# EAGLE design Solar_revb (EAGLE 7.7.0)
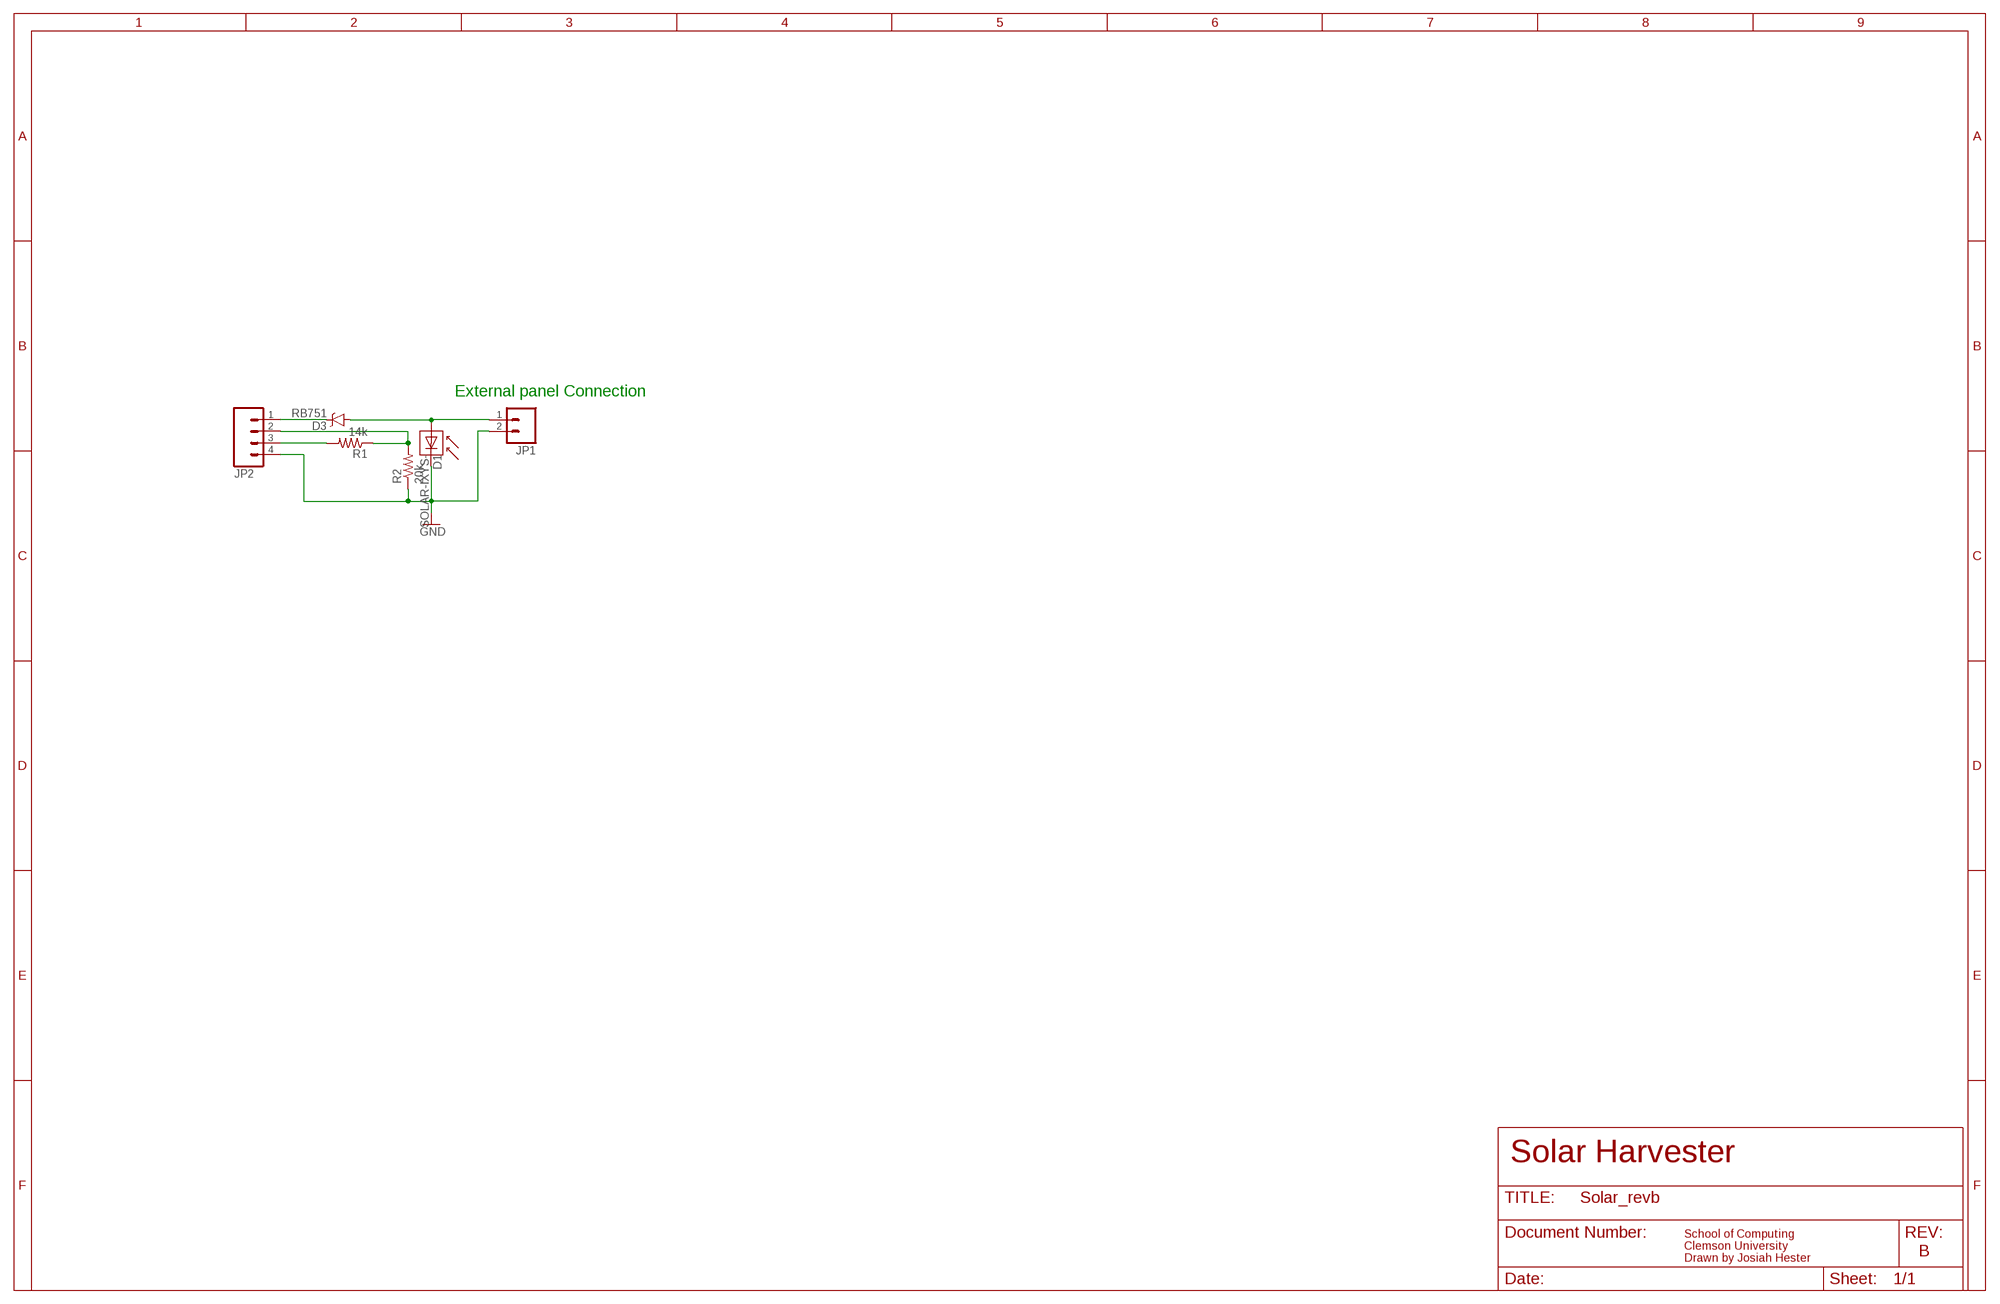
[diagram p0: schematic, sheet 1]

## Parts
D1  SOLAR-IXYS-  [SOLARBIT-12X1]
D3  RB751  DIODE-SCHOTTKY-RB751  [SOD-523]
JP1  M02LOCK  [1X02_LOCK]
JP2  M041.27MM  [1X04-1.27MM]
R1  14k  R-EU0603  [0603]
R2  20k  R-EU0603  [0603]

## Nets
GND: D1.-(C) JP1.2 JP2.4 R2.1
N$1: JP2.2 R1.1 R2.2
N$2: D1.+(A) D3.A JP1.1
N$3: JP2.3 R1.2
N$4: D3.C JP2.1

## Notes on the sheet
- External panel Connection
- Solar Harvester
- B
- School of Computing
  Clemson University
  Drawn by Josiah Hester

## Library data of the parts
D1 = SparkFun-Sensors:SOLAR-IXYS; DIGIKEY: KXOB22-01X8F-ND
D3 = SparkFun-DiscreteSemi:DIODE-SCHOTTKY: Schottky diodes in SFE's production catalog BAT20J 1A 23V 0.62Vf RB751 120mA 40V 0.37Vf PMEG4005EJ 0.5A 40V 0.42Vf MBRA140 1A 40V 0.5Vf B340A 3A 40V SMA; MPN: BAS40-02V-V-G-08; PROD_ID: DIO-11018
JP1 = SparkFun-Connectors:M02: Standard 2-pin 0.1" header. Use with - straight break away headers ( PRT-00116) - right angle break away headers (PRT-00553) - swiss pins (PRT-00743) - machine pins (PRT-00117) - female headers (PRT-00115) Molex polarized connector foot print use with: PRT-08233 with associated crimp pins and housings. 2.54_SCREWTERM for use with PRT-10571. 3.5mm Screw Terminal footprints for PRT-08084 5mm Screw Terminal footprints for use with PRT-08432
JP2 = SparkFun-Connectors:M04: Header 4 Standard 4-pin 0.1" header. Use with straight break away headers (SKU : PRT-00116), right angle break away headers (PRT-00553), swiss pins (PRT-00743), machine pins (PRT-00117), and female headers (PRT-00115). Molex polarized connector foot print use with SKU : PRT-08231 with associated crimp pins and housings. 1MM SMD Version SKU: PRT-10208; MPN: GRPB041VWVN-RC
R1 = tiny_passives:R-EU; MPN: CRCW060314K0FKEA
R2 = tiny_passives:R-EU; MPN: CRCW060320K0FKEA

## Board
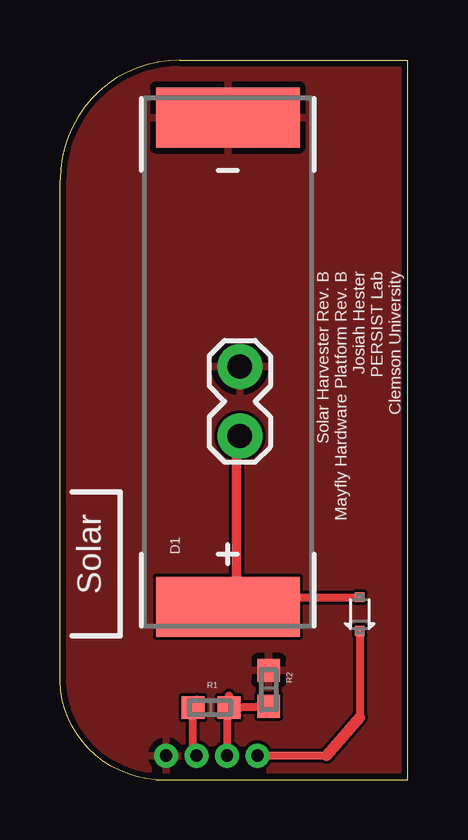
[diagram p1: board, top side]
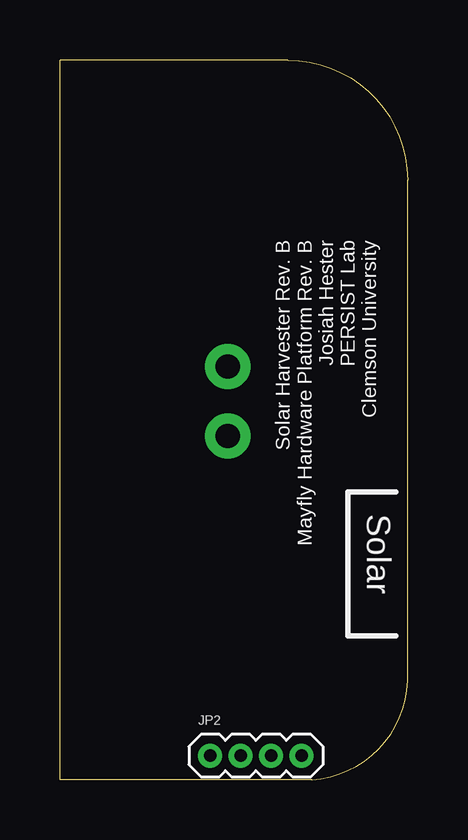
[diagram p2: board, bottom side, seen from below]

Size 14.5 x 30 mm. Coordinates in mm from the lower left corner, seen from the top.
Outline: 0,4.5 0,25 arc-90 5,30 14.5,30 14.5,0 4,0 arc-90 0,4.5
Copper layers (1*16): Top 0.035mm / dielectric 1.5mm / Bottom 0.035mm
Design rules "MF_Standard_2_Layer": minimum track width 5mil, minimum drill 12mil, track to track 5mil, track to pad 5mil, pad to pad 5mil, via to via 5mil, smd to smd 0mil, copper to edge 10mil, drill to drill 10mil, minimum pad ring 6mil, minimum via ring 6mil, stop-mask expansion 2mil, vias tented up to drill 25mil, thermal gap 10mil

### Footprints (pad centres in the part's own frame; a part is rotated, then mirrored left to right if it is on the bottom)
SOLARBIT-12X1 = smd 2.5 x 6: + -10.2,0; - 10.2,0
SOD-523 = smd 0.4 x 0.4: A -0.7,0; C 0.7,0
1X02_LOCK = drill 1.016 pad 1.88: 1 -0.178,0; 2 2.718,0
1X04-1.27MM = drill 0.508 pad 1: 1 0,0; 2 1.27,0; 3 2.54,0; 4 3.81,0
0603 = smd 0.95 x 0.95: 1 -0.75,0; 2 0.75,0

### Placement (x,y rotation side)
D1  7,17.4 90 top
D3  12.5,6.9 270 top
JP1  7.5,14.5 90 top
JP2  8.23,1 0 bottom
R1  6.3,3 180 top
R2  8.7,3.8 270 top

### Tracks (layer width: path | path; a pad name or v marks a point on that pad's centre or on a via)
GND
  pour Top: 0,0 14.5,0 15,30.5 0,30.5
N$1
  Top 0.333: R1.1 6.96,2.91 JP2.2
  Top 0.344: 7.04,3.49 R1.1 R2.2
N$2
  Top 0.333: D1.+ 7.35,7.65 7.4,7.6 D3.A
  Top 0.4: JP1.1 7.35,14.17 7.35,7.65
N$3
  Top 0.333: 5.71,3.34 R1.2 5.55,1.14 JP2.3
N$4
  Top 0.333: D3.C 12.5,2.6 | 11.1,1 JP2.1
  Top 0.44: 11.1,1 12.5,2.6

### Text on the board
tPlace: Solar Harvester Rev. B / Mayfly Hardware Platform Rev. B / Josiah Hester / PERSIST Lab / Clemson University | Solar
bPlace: Solar Harvester Rev. B / Mayfly Hardware Platform Rev. B / Josiah Hester / PERSIST Lab / Clemson University | Solar